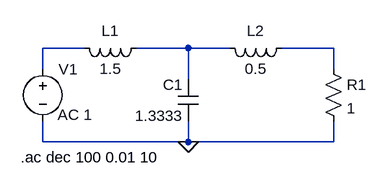
[diagram p0: schematic punto2.asc]
punto2.asc, the LTspice schematic file:
Version 4
SHEET 1 880 680
WIRE -16 80 -80 80
WIRE 144 80 64 80
WIRE 208 80 144 80
WIRE 368 80 288 80
WIRE -80 112 -80 80
WIRE 368 112 368 80
WIRE 144 128 144 80
WIRE -80 224 -80 192
WIRE 144 224 144 192
WIRE 144 224 -80 224
WIRE 368 224 368 192
WIRE 368 224 144 224
FLAG 144 224 0
SYMBOL cap 160 192 R180
WINDOW 0 24 56 Left 2
WINDOW 3 24 8 Left 2
SYMATTR InstName C1
SYMATTR Value 1.3333
SYMBOL ind 80 64 R90
WINDOW 0 5 56 VBottom 2
WINDOW 3 32 56 VTop 2
SYMATTR InstName L1
SYMATTR Value 1.5
SYMBOL ind 304 64 R90
WINDOW 0 5 56 VBottom 2
WINDOW 3 32 56 VTop 2
SYMATTR InstName L2
SYMATTR Value 0.5
SYMBOL res 352 96 R0
SYMATTR InstName R1
SYMATTR Value 1
SYMBOL voltage -80 96 R0
WINDOW 123 23 86 Left 2
WINDOW 39 0 0 Left 0
SYMATTR InstName V1
SYMATTR Value ""
SYMATTR Value2 AC 1
TEXT -114 248 Left 2 !.ac dec 100 0.01 10

The netlist it stands for:
* punto2.asc
C1 0 N002 1.3333
L1 N002 N001 1.5
L2 N003 N002 0.5
R1 N003 0 1
V1 N001 0 AC 1
.ac dec 100 0.01 10
.backanno
.end